# Altium schematic sheet Sheet_Power.SchDoc
size A4
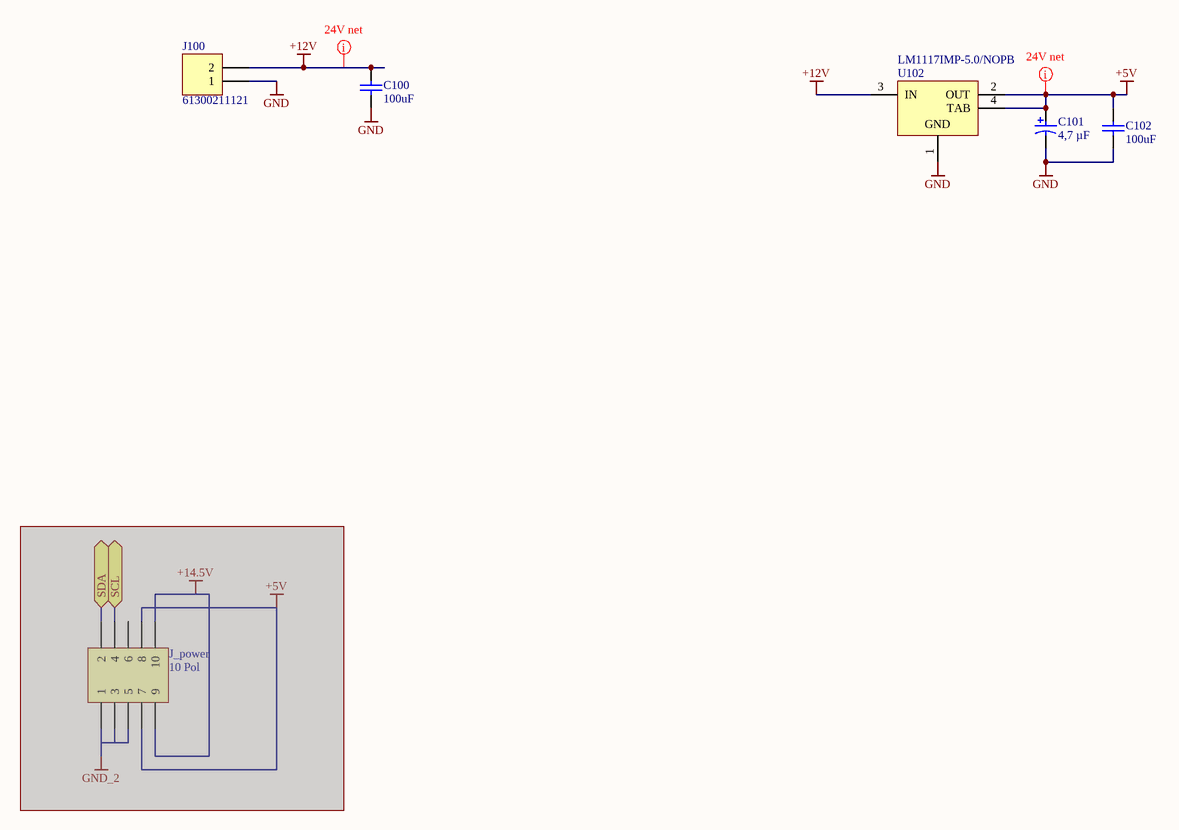
[diagram p0: Sheet_Power.SchDoc]

## Parts
C100  100uF  [CAPC1206(3216)190_L]
C101  4,7 µF  [A Package]
C102  100uF  [CAPC1206(3216)190_L]
J100  61300211121  [61300211121]
J_power  10 Pol  [WR-BHD_612 010 221 21]  (masked out: inside a compile mask, not in the netlist)
U102  LM1117IMP-5.0/NOPB  [DCY0004A_M]

## Ports
SCL (bidir), SDA (bidir)

## Nets
+5V: C101.1 C102.2 U102.2(OUT) U102.4(TAB)
+12V: C100.2 J100.2 U102.3(IN)
GND: C100.1 C101.2 C102.1 J100.1 U102.1(GND)

## Layout directives
net class 24V_net: +5V, +12V

## Library data of the parts
C100 C102 = CMP-00469-2: CAP 100uF 6.3V ±20% 1206 (3216 Metric) Thickness 1.9mm SMD; PartNumber: 885012108005; Manufacturer: WURTH ELEKTRONIK; Tolerance: Â±20%; Case-EIA: 1206; Case-Metric: 3216; Technology: SMT; Max Thickness: 1.9 mm; Rated Voltage: 6.3 V; Value: 100uF; Supplier: Farnell; Supplier Part Number: 2495155; ComponentLink1Description: 2326302.pdf; ComponentLink1URL: http://www.farnell.com/cad/2326302.pdf; ComponentLink2Description: 1958456.pdf; ComponentLink2URL: http://www.farnell.com/datasheets/1958456.pdf; Manufacturer Part Number: 885012108005
C101 = CMP-001-0039-3: 4,7 µF; 6V; Gr. A; T491A475K006AT; Manufacturer: KEMET; Capacitance: 4.7µF; ESR (Equivalent Series Resistance): 6 Ohm; Lifetime @ Temp.: 2000 Hrs @ 85°C; Tolerance: ±10%; Type: Molded; Voltage - Rated: 6.3V; ComponentLink1Description: KEM_T2005_T491.pdf; ComponentLink1URL: http://www.kemet.com/Lists/ProductCatalog/Attachments/254/KEM_T2005_T491.pdf; Failure Rate: -; Features: General Purpose; Height - Seated (Max): 0.071" (1.80mm); Lead Spacing: -; Manufacturer Size Code: A; Mounting Type: Surface Mount; Operating Temperature: -55°C ~ 125°C; Package / Case: 1206 (3216 Metric); Packaging: Cut Tape (CT); Part Status: Active; Size / Dimension: 0.126" L x 0.063" W (3.20mm x 1.60mm); Supplier: Digi-Key; Supplier Part Number: 399-9717-1-ND; PartNumber: T491A475K006AT
J100 = CMP-001-0071-1: 2Pol; gerade; WR-PHD 2.54 mm THT Pin Header; Brand: Wurth Electronics; Current Rating: 3 A; Insulation Resistance: 1 GOhms; Latching Type: Unlatched; Mating Post Length: 6 mm; Mounting Angle: Straight; Number of Positions: 2 Position; Pitch: 2.54 mm; Voltage Rating: 250 V; Accessory Type: -; Application: Wire to Board; ComponentLink1Description: 6130xx11121-538006.pdf; ComponentLink1URL: http://www.mouser.com/ds/2/445/6130xx11121-538006.pdf; Contact Gender: Pin (Male); Contact Material: Copper Alloy; Contact Plating: Gold; Contact Type: -; Flammability Rating: UL 94 V-0; Housing Gender: -; Housing Material: Polybutylene Terephthalate (PBT); Manufacturer: Wurth Electronics; Manufacturer Part Number: 61300211121; Minimum Order Quantity: 1; Mounting Style: Straight Pin; Number of Rows: 1 Row; Packaging: Bulk; Product: Headers; Reeling: False; RoHS - Mouser: Y; Row Spacing: -; Series: WR-PHD; Standard Pack Qty: 1000; Supplier: Mouser; Supplier Part Number: 710-61300211121; Termination Post Length: 3 mm; Termination Style: Through Hole; Type: Pin Strip; PartNumber: 61300211121
J_power = 10 Pol _ 2,54mm_ 612 010 2xx 21: Manufacturer: W¨¹rth Elektronik eiSos GmbH; partNo: 61201021621; ComponentLink1 Description: Manufacturer; ComponentLink2 Description: Datasheet; NoPins: 10; Created Date: 6 May 2013; ComponentLink1URL: http://www.we-online.com; ComponentLink2URL: http://katalog.we-online.de/em/datasheet/6120xx21621.pdf; Created by: Karrer Zheng
U102 = CMP-00485-1: 800mA Low-Dropout Linear Regulator, 4-pin SOT-223, Pb-Free; Manufacturer: Texas Instruments; PackageTopMarking: XYTT*N06B; CompType: LDO IC; PowerWise: N; High-Reliability: Y; RoHS: Y; Code_JEDEC: TO-261-AA; ComponentLink1URL: http://www.ti.com/general/docs/lit/getliterature.tsp?genericPartNumber=LM1117-N&fileType=pdf; Code_IPC: SOT223-4; ComponentLink1Description: Datasheet URL; PartNumber: LM1117IMP-5.0/NOPB; PackageReference: DCY0004A; PinCount: 4; PackageDescription: Molded SOT-223, 6.50 x 3.56 x 1.6mm Body, 4 Lead, 2.3mm Pitch